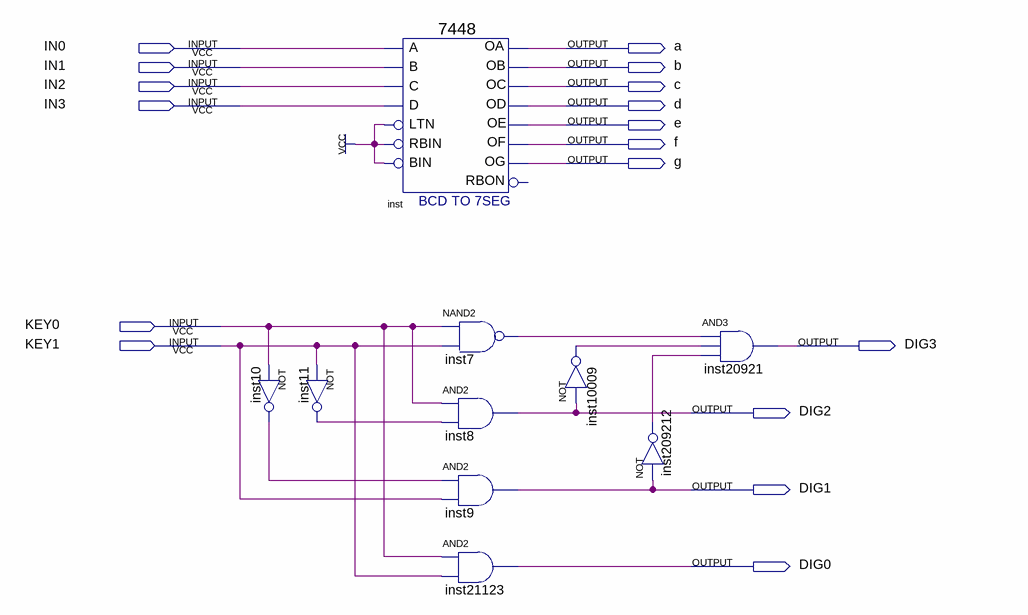
[diagram p0: schematic sheet]
// Quartus schematic DIGLight.bdf as structural Verilog: 10 symbols, 17 pins
module DIGLight (
  input  IN0,
  input  IN1,
  input  IN2,
  input  IN3,
  input  KEY0,
  input  KEY1,
  output a,
  output b,
  output c,
  output d,
  output e,
  output f,
  output g,
  output DIG3,
  output DIG2,
  output DIG1,
  output DIG0
);

  wire inst7_out, inst10_out, inst11_out, inst10009_out, inst209212_out;

  not inst10 (inst10_out, KEY0);
  not inst11 (inst11_out, KEY1);
  \7448  inst (
    .A(IN0), .C(IN2), .D(IN3), .B(IN1), .RBIN(1'b1), .BIN(1'b1), .LTN(1'b1), .OC(c), .OE(e), .OD(d), .OF(f),
    .OG(g), .OB(b), .OA(a));  // open: RBON
  nand inst7 (inst7_out, KEY0, KEY1);
  and inst8 (DIG2, KEY0, inst11_out);
  and inst9 (DIG1, inst10_out, KEY1);
  and inst21123 (DIG0, KEY0, KEY1);
  not inst10009 (inst10009_out, DIG2);
  not inst209212 (inst209212_out, DIG1);
  and inst20921 (DIG3, inst7_out, inst10009_out, inst209212_out);
endmodule
